# EAGLE schematic Main (EAGLE 9.6.2)
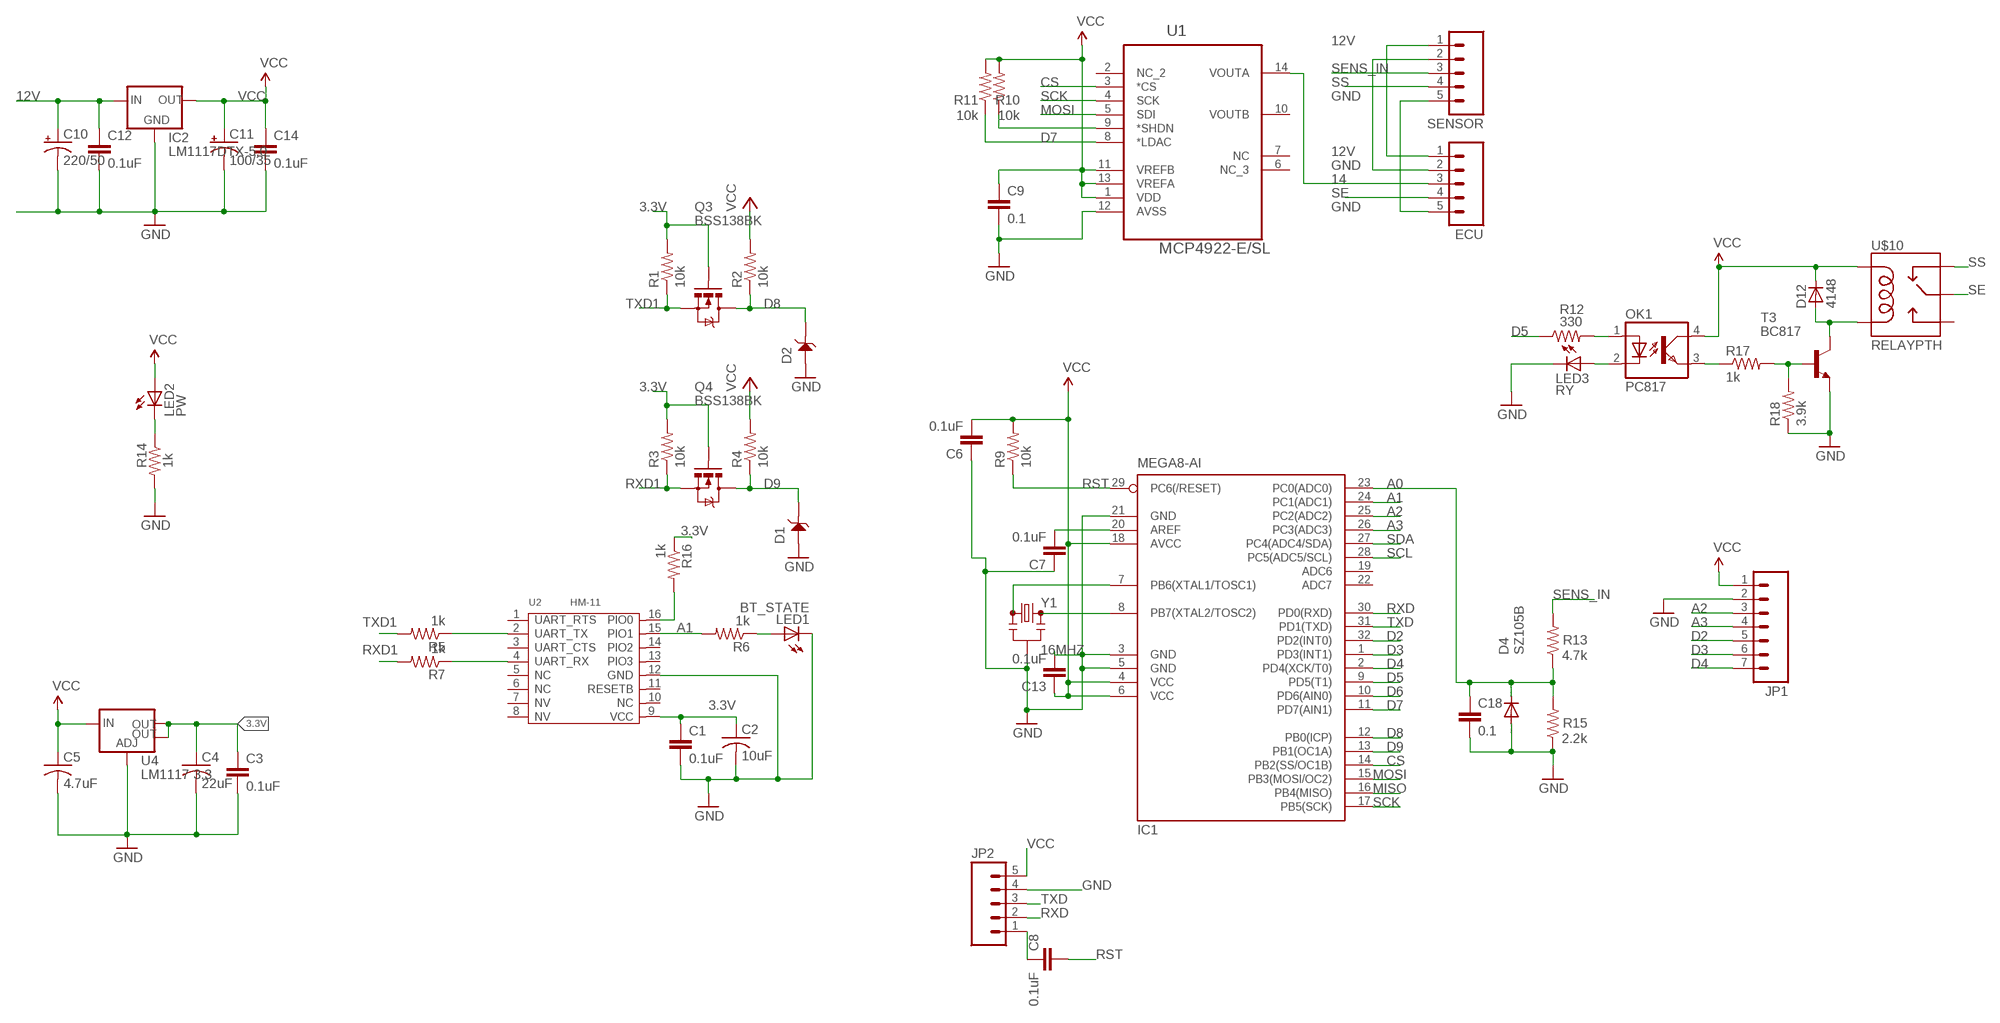
[diagram p0: schematic, sheet 1]

## Parts
C1  0.1uF  CAP0805  [0805]
C2  10uF  C-USC1206  [C1206]
C3  0.1uF  CAP0805  [0805]
C4  22uF  C-USC1206  [C1206]
C5  4.7uF  C-USC1206  [C1206]
C6  0.1uF  CAP0805  [0805]
C7  0.1uF  CAP0805  [0805]
C8  0.1uF  CAP0805  [0805]
C9  0.1  CAP0805  [0805]
C10  220/50  CPOL-US153CLV-1010  [153CLV-1010]
C11  100/35  CPOL-US153CLV-0605  [153CLV-0605]
C12  0.1uF  CAP0805  [0805]
C13  0.1uF  CAP0805  [0805]
C14  0.1uF  CAP0805  [0805]
C18  0.1  CAP0805  [0805]
D1  SMF5.0A  D-ESD-2P'CESD5V0D1'  [SOD123-2.7X1.6]
D2  SMF5.0A  D-ESD-2P'CESD5V0D1'  [SOD123-2.7X1.6]
D4  SZ105B  DIODE-DO-214AC  [DO-214AC]
D12  4148  D-SOD-80  [SOD80]
ECU  M05PTH  [1X05]
IC1  MEGA8-AI  [TQFP32-08]
IC2  LM1117DTX-5.0  LM1117DTX-3.3  [TO252]
JP1  M07  [1X07]
JP2  M05PTH  [1X05]
LED1  BT_STATE  LED3MM  [LED3MM]
LED2  PW  LED3MM  [LED3MM]
LED3  RY  LED3MM  [LED3MM]
OK1  PC817  LTV816S  [DIL4-SMD]
Q3  BSS138BK  MOSFET-NCHANNELBSS138  [SOT23-3]
Q4  BSS138BK  MOSFET-NCHANNELBSS138  [SOT23-3]
R1  10k  RESISTOR0805-RES  [0805]
R2  10k  RESISTOR0805-RES  [0805]
R3  10k  RESISTOR0805-RES  [0805]
R4  10k  RESISTOR0805-RES  [0805]
R5  1k  RESISTOR0805-RES  [0805]
R6  1k  RESISTOR0805-RES  [0805]
R7  1k  RESISTOR0805-RES  [0805]
R9  10k  RESISTOR0805-RES  [0805]
R10  10k  RESISTOR0805-RES  [0805]
R11  10k  RESISTOR0805-RES  [0805]
R12  330  RESISTOR0805-RES  [0805]
R13  4.7k  RESISTOR0805-RES  [0805]
R14  1k  RESISTOR0805-RES  [0805]
R15  2.2k  RESISTOR0805-RES  [0805]
R16  1k  RESISTOR0805-RES  [0805]
R17  1k  RESISTOR0805-RES  [0805]
R18  3.9k  RESISTOR0805-RES  [0805]
SENSOR  M05PTH  [1X05]
T3  BC817  BC817-16-NPN-SOT23-BEC  [SOT23-BEC]
U1  MCP4922-E/SL  [SOIC127P600X175-14N]
U2  HM-11  [16P-18.5X13.5X0.8]
U4  LM1117 3.3  V_REG_LM1117SOT223  [SOT223]
U$10  RELAYPTH  [SRD-05VDC-SL-C]
Y1  16MHZ  RESONATOR16MHZ  [RESONATOR-SMD]

## Nets
3.3V: C1.1 C2.1 C3.1 C4.1 Q3.1(G) Q4.1(G) R1.2 R3.2 R16.1 U2.9(VCC) U4.2(OUT) U4.4(OUT)
12V: C10.+ C12.1 ECU.1 IC2.2(IN) SENSOR.1
14: ECU.3 U1.14(VOUTA)
A0: C18.1 D4.C IC1.23(PC0(ADC0)) R13.1 R15.2
A1: IC1.24(PC1(ADC1)) R6.2 U2.15(PIO1)
A2: IC1.25(PC2(ADC2)) JP1.3
A3: IC1.26(PC3(ADC3)) JP1.4
CS: IC1.14(PB2(SS/OC1B)) U1.3(*CS)
D2: IC1.32(PD2(INT0)) JP1.5
D3: IC1.1(PD3(INT1)) JP1.6
D4: IC1.2(PD4(XCK/T0)) JP1.7
D5: IC1.9(PD5(T1)) R12.1
D6: IC1.10(PD6(AIN0))
D7: IC1.11(PD7(AIN1)) R11.1 U1.8(*LDAC)
D8: D2.2 IC1.12(PB0(ICP)) Q3.3(D) R2.1
D9: D1.2 IC1.13(PB1(OC1A)) Q4.3(D) R4.1
GND: C1.2 C2.2 C3.2 C4.2 C5.2 C6.1 C7.1 C9.2 C10.- C11.- C12.2 C13.2 C14.2 C18.2 D1.1 D2.1 D4.A ECU.2 ECU.5 IC1.3(GND) IC1.5(GND) IC1.21(GND) IC2.1(GND) JP1.2 JP2.4 LED1.K(C) LED3.K(C) R14.2 R15.1 R18.1 SENSOR.2 SENSOR.5 T3.E U1.12(AVSS) U2.12(GND) U4.1(ADJ) Y1.2
MISO: IC1.16(PB4(MISO))
MOSI: IC1.15(PB3(MOSI/OC2)) U1.5(SDI)
N$1: LED1.A R6.1
N$2: R16.2 U2.16(PIO0)
N$3: R5.1 U2.2(UART_TX)
N$5: IC1.8(PB7(XTAL2/TOSC2)) Y1.3
N$6: R7.1 U2.4(UART_RX)
N$7: IC1.7(PB6(XTAL1/TOSC1)) Y1.1
N$8: C7.2 IC1.20(AREF)
N$10: C8.1 JP2.1
N$12: LED2.K(C) R14.1
N$16: R10.1 U1.9(*SHDN)
N$20: OK1.3(EMIT) R17.1
N$21: R17.2 R18.2 T3.B
N$22: D12.2(A) T3.C U$10.COIL0
N$23: OK1.1(A) R12.2
N$31: LED3.A OK1.2(C)
RST: C8.2 IC1.29(PC6(/RESET)) R9.1
RXD: IC1.30(PD0(RXD)) JP2.2
RXD1: Q4.2(S) R3.1 R7.2
SCK: IC1.17(PB5(SCK)) U1.4(SCK)
SCL: IC1.28(PC5(ADC5/SCL))
SDA: IC1.27(PC4(ADC4/SDA))
SE: ECU.4 U$10.SWCOMMON
SENS_IN: R13.2 SENSOR.3
SS: SENSOR.4 U$10.SWCLOSED(SWCLOSE)
TXD: IC1.31(PD1(TXD)) JP2.3
TXD1: Q3.2(S) R1.1 R5.2
VCC: C5.1 C6.2 C9.1 C11.+ C13.1 C14.1 D12.1(C) IC1.4(VCC) IC1.6(VCC) IC1.18(AVCC) IC2.TAB(OUT) JP1.1 JP2.5 LED2.A OK1.4(COL) R2.2 R4.2 R9.2 R10.2 R11.2 U1.1(VDD) U1.11(VREFB) U1.13(VREFA) U4.3(IN) U$10.COIL1
Unconnected: IC1.19(ADC6) IC1.22(ADC7) U1.2(NC_2) U1.6(NC_3) U1.7(NC) U1.10(VOUTB) U2.1(UART_RTS) U2.3(UART_CTS) U2.5(NC) U2.6(NC) U2.7(NV) U2.8(NV) U2.10(NC) U2.11(RESETB) U2.13(PIO3) U2.14(PIO2) U$10.SWOPEN

## Library data of the parts
C1 = SparkFun-Capacitors:CAP: Capacitor Standard 0603 ceramic capacitor, and 0.1" leaded capacitor.
C2 C4 C5 = adafruit:C-US: CAPACITOR, American symbol
C3 C6-C9 C12-C14 C18 = SparkFun-Passives:CAP: Capacitor Standard 0603 ceramic capacitor, and 0.1" leaded capacitor.
C10 C11 = adafruit:CPOL-US: POLARIZED CAPACITOR, American symbol
D1 D2 = discrete:D-ESD-2P: Diodes for Protectiong against ESD
D4 = diode:DIODE-: DIODE
D12 = semicon-smd-ipc:D-: DIODE unfilled
ECU JP2 SENSOR = SparkFun:M05: Header 5 Standard 5-pin 0.1" header. Use with straight break away headers (SKU : PRT-00116), right angle break away headers (PRT-00553), swiss pins (PRT-00743), machine pins (PRT-00117), and female headers (PRT-00115). Molex polarized connector foot print use with SKU : PRT-08230 with associated crimp pins and housings.
IC1 = atmel:MEGA8: MICROCONTROLLER 8 Kbytes FLASH, 1 kbytes SRAM, 512 bytes EEPROM, USART, 6-channel 10 bit ADC, 2-channel 8 bit ADC Pin compatible with Atmega48, ATMega88, ATMega168 Source: avr.lbr; MPN: ATMEGA8-16AU; OC_FARNELL: 9171371; OC_NEWARK: 73M8863
IC2 = lm1117:LM1117DTX-*
JP1 = SparkFun:M07: Header 7 Standard 7-pin 0.1" header. Use with straight break away headers (SKU : PRT-00116), right angle break away headers (PRT-00553), swiss pins (PRT-00743), machine pins (PRT-00117), and female headers (PRT-00115). NOTES ON THE VARIANTS LOCK and LOCK_LONGPADS... This footprint was designed to help hold the alignment of a through-hole component (i.e. 7-pin header) while soldering it into place. You may notice that each hole has been shifted either up or down by 0.005 of an inch from it's more standard position (which is usually a perfectly straight line). This slight alteration caused the pins (the squares in the middle) to touch the edges of the holes. Because they are alternating, it causes a "brace" to hold the header in place. 0.005 has proven to be the perfect amount of "off-center" position when using our standard breakaway headers. Although looks a little odd when you look at the bare footprint, once you have a header in there, the alteration is very hard to notice. Also, if you push a header all the way into place, it is covered up entirely on the bottom side. This idea of altering the position of holes to aid alignment will be further integrated into the Sparkfun Library for other footprints. It can help hold any component with 3 or more connection pins.
LED1-LED3 = adafruit:LED: LED OSRAM: - CHIPLED LG R971, LG N971, LY N971, LG Q971, LY Q971, LO R971, LY R971 LH N974, LH R974 LS Q976, LO Q976, LY Q976 LO Q996 - Hyper CHIPLED LW Q18S LB Q993, LB Q99A, LB R99A - SideLED LS A670, LO A670, LY A670, LG A670, LP A670 LB A673, LV A673, LT A673, LW A673 LH A674 LY A675 LS A676, LA A676, LO A676, LY A676, LW A676 LS A679, LY A679, LG A679 - Hyper Micro SIDELED® LS Y876, LA Y876, LO Y876, LY Y876 LT Y87S - SmartLED LW L88C, LW L88S LB L89C, LB L89S, LG L890 LS L89K, LO L89K, LY L89K LS L896, LA L896, LO L896, LY L896 - TOPLED LS T670, LO T670, LY T670, LG T670, LP T670 LSG T670, LSP T670, LSY T670, LOP T670, LYG T670 LG T671, LOG T671, LSG T671 LB T673, LV T673, LT T673, LW T673 LH T674 LS T676, LA T676, LO T676, LY T676, LB T676, LH T676, LSB T676, LW T676 LB T67C, LV T67C, LT T67C, LS T67K, LO T67K, LY T67K, LW E67C LS E67B, LA E67B, LO E67B, LY E67B, LB E67C, LV E67C, LT E67C LW T67C LS T679, LY T679, LG T679 LS T770, LO T770, LY T770, LG T770, LP T770 LB T773, LV T773, LT T773, LW T773 LH T774 LS E675, LA E675, LY E675, LS T675 LS T776, LA T776, LO T776, LY T776, LB T776 LHGB T686 LT T68C, LB T68C - Hyper Mini TOPLED® LB M676 - Mini TOPLED Santana® LG M470 LS M47K, LO M47K, LY M47K Source: http://www.osram.convergy.de/
OK1 = optocoupler:LTV816: OPTO COUPLER Source: LITEON, LTV816.pdf
Q3 Q4 = SparkFun-DiscreteSemi:MOSFET-NCHANNEL: Common NMOSFET Parts MFG P/N Store ID Prod ID FDD8780 TRANS-09984 SI7820DN TRANS-11055 FDS6630A IC-08089 2N7002PW TRANS-11151 FQP30N06L COM-10213 TRANS-10060 BSS123LT1G TRANS-08345 BSS138 TRANS-00830 BS170 2N7000; PROD_ID: TRANS-00830; VALUE: 200mA/50V
R1-R7 R9-R11 R13-R16 = SparkFun-Resistors:RESISTOR: Resistor Basic schematic elements and footprints for 0603, 1206, and PTH resistors.
R12 R17 R18 = SparkFun-Passives:RESISTOR: Resistor Basic schematic elements and footprints for 0603, 1206, and PTH resistors.
T3 = transistor:*-NPN-: NPN Transistror BF959 corrected 2008.03.06
U1 = Microchip_By_element14_Batch_1:MCP4922-E/SL: IC, 12BIT DAC DUAL, SPI I/F; MPN: MCP4922-E/SL; OC_FARNELL: 1332114; OC_NEWARK: 08J8748; PACKAGE: SOIC14; SUPPLIER: Microchip
U2 = template:HM-11: Bluetooth Specification V4.0 BLE
U4 = SparkFun-PowerIC:V_REG_LM1117: Voltage Regulator LM1117 Standard adjustable voltage regulator but in SMD form. Spark Fun Electronics SKU : COM-00595; PROD_ID: VREG-08170
U$10 = SRD-05VDC-SL-C:RELAY: SPDT relay (COM-00101)
Y1 = SparkFun-FreqCtrl:RESONATOR: Resonator Small SMD resonator. Used, eg, on the Arduino Pro/ Pro Mini boards. 8MHz- XTAL-08895 16MHz- XTAL-08900; PROD_ID: XTAL-08900

## Net classes
1 power: width 0.203 mm